# Altium schematic sheet fpga.SchDoc
size A2
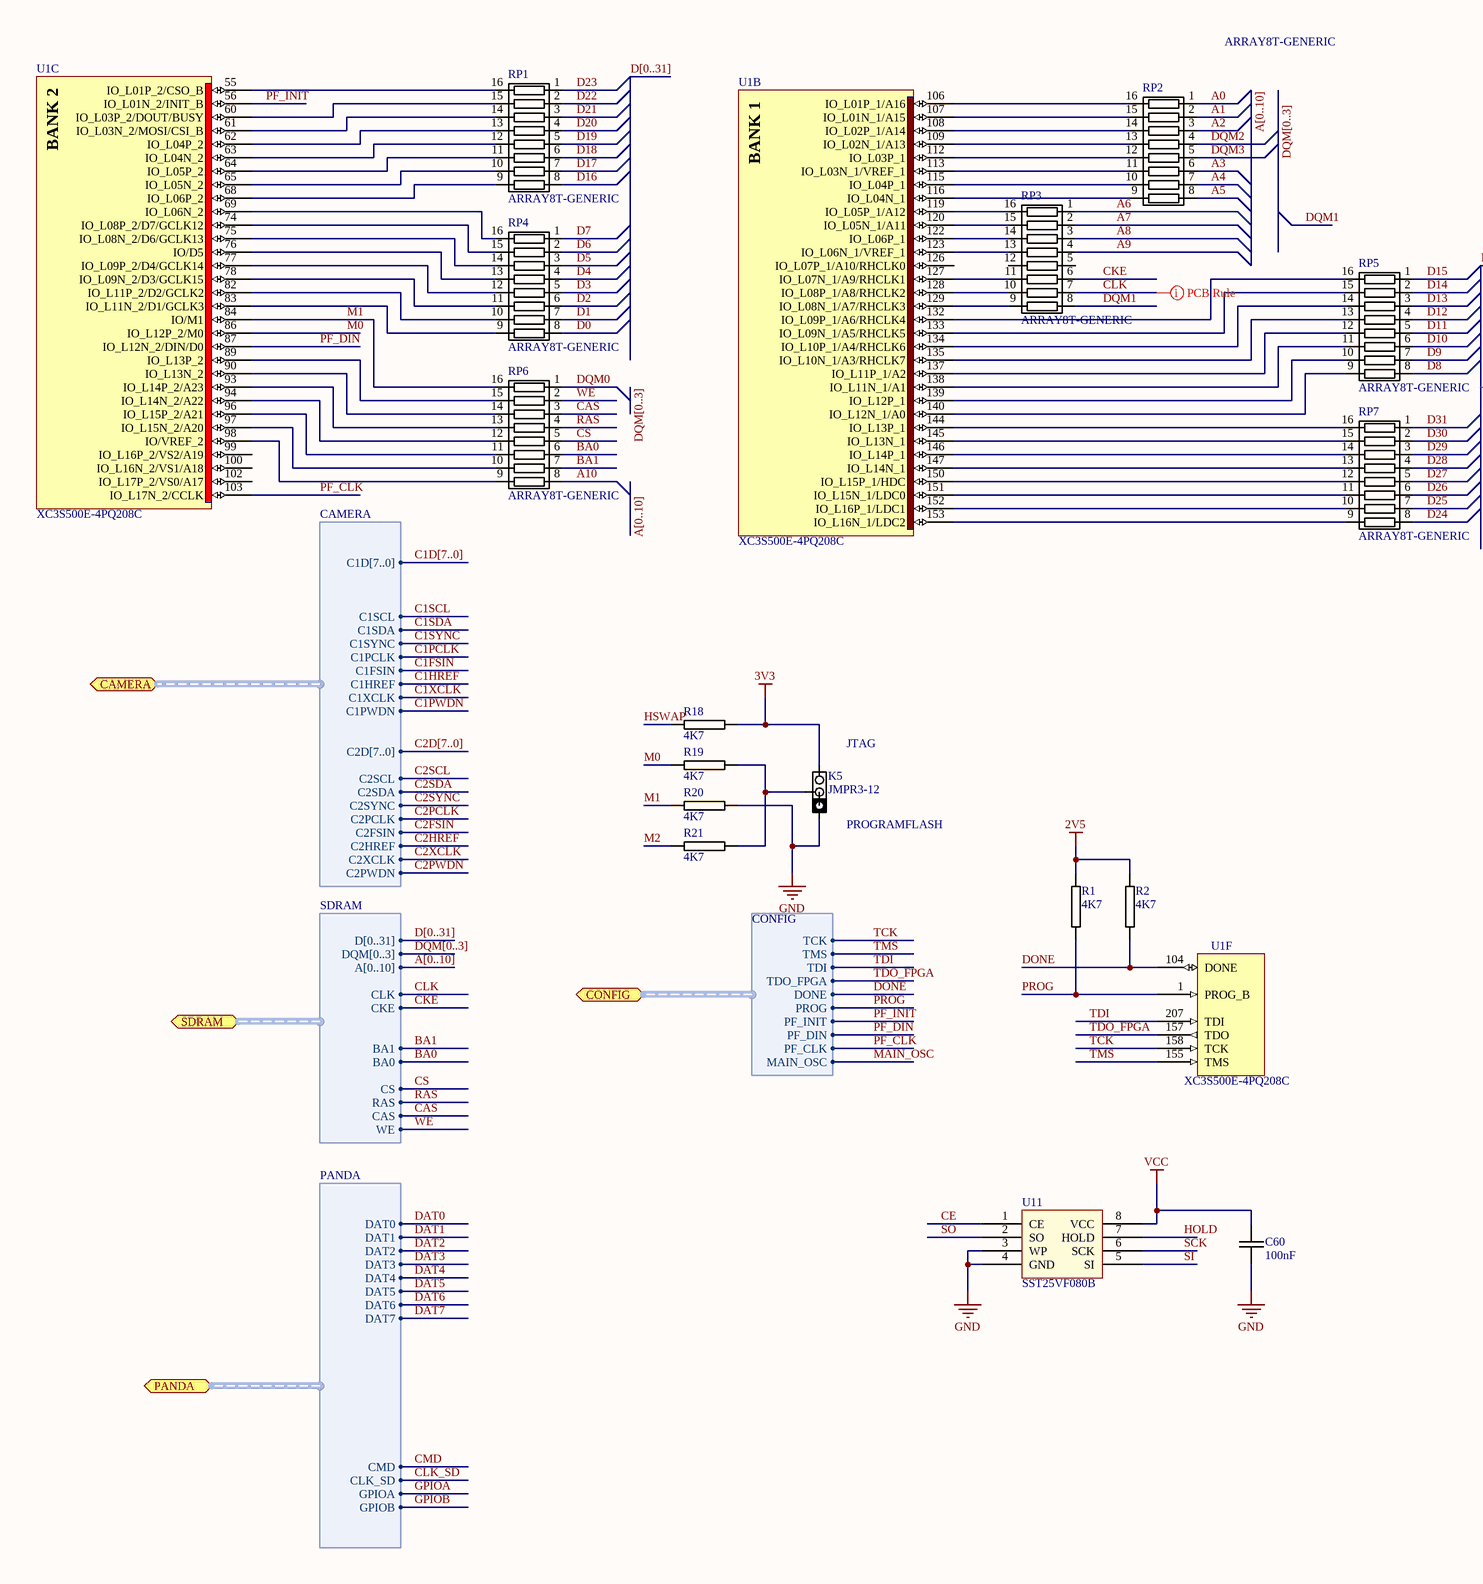
[diagram p0: fpga.SchDoc, left]
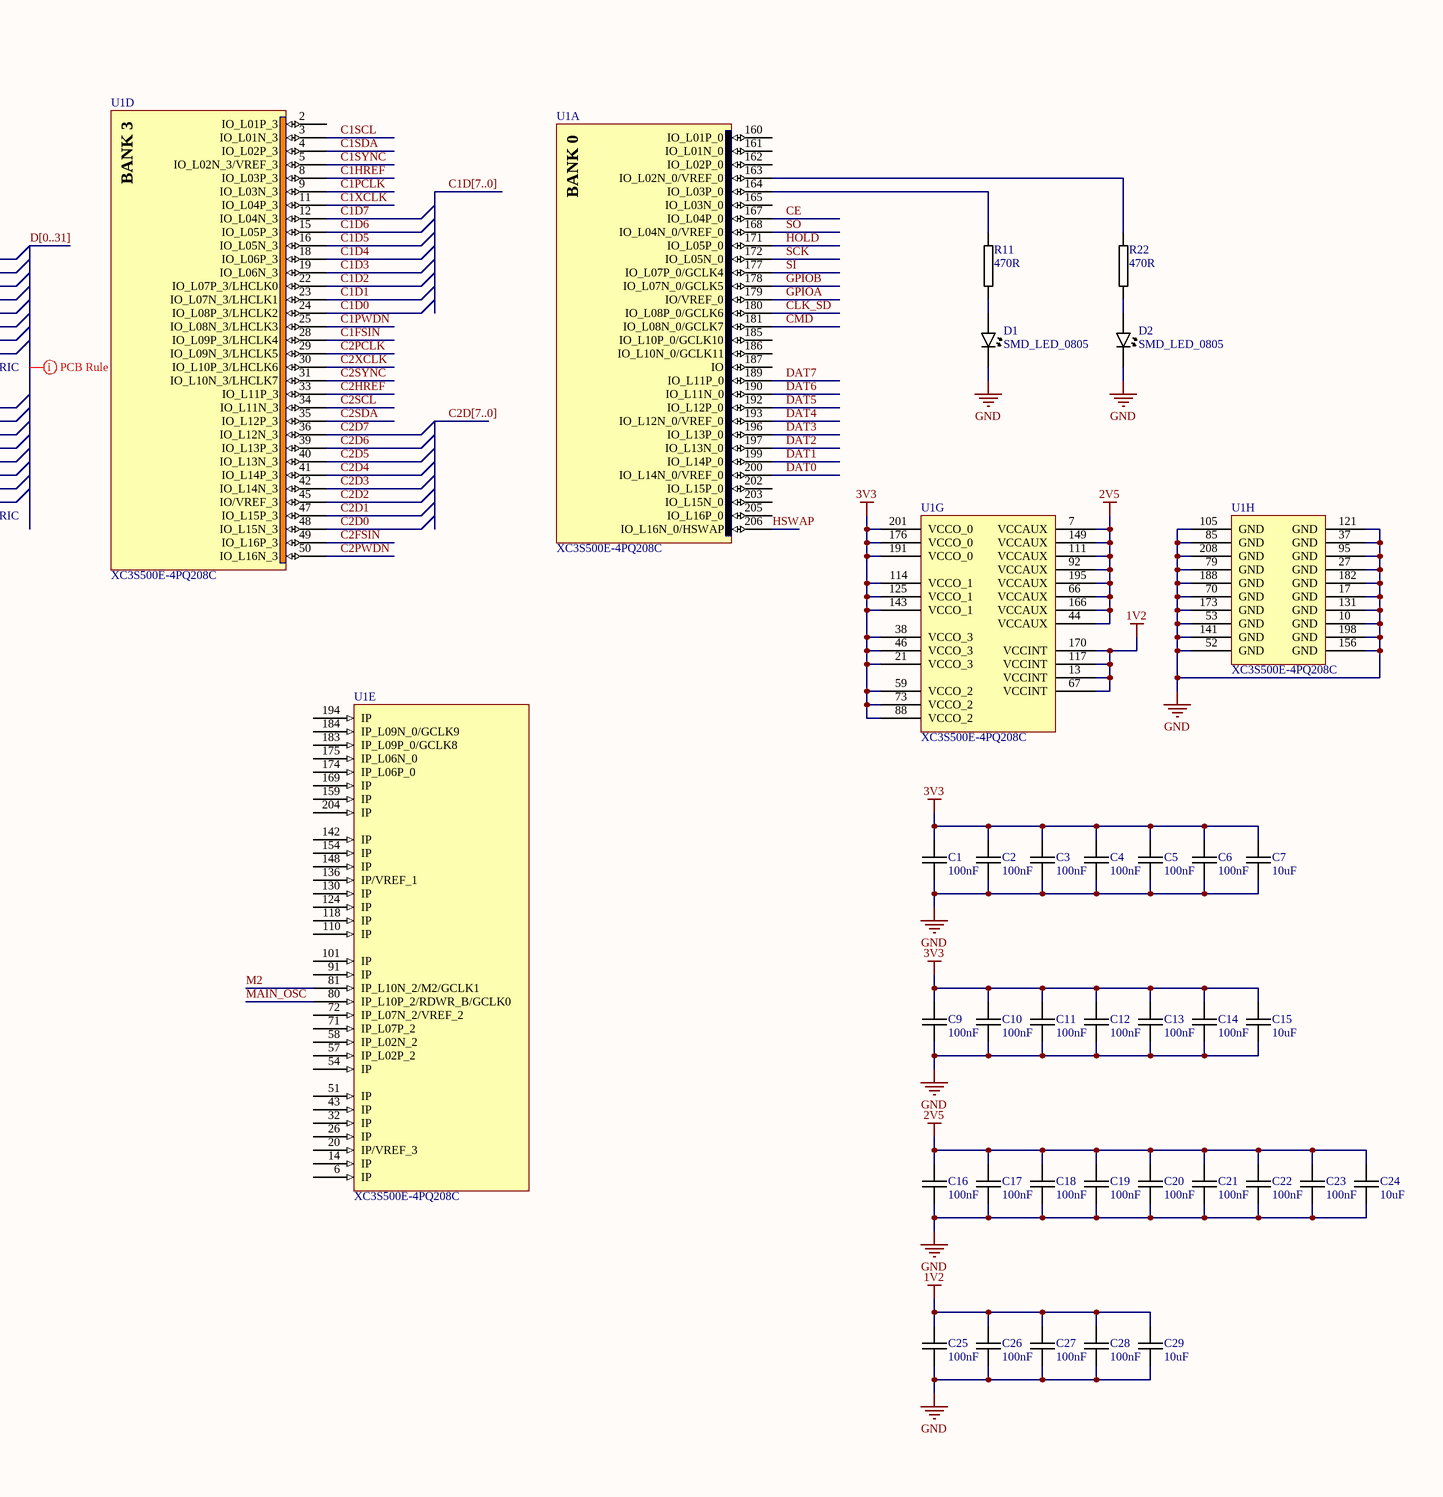
[diagram p1: fpga.SchDoc, right]

## Parts
C1  100nF  [0603C-GENERIC]
C2  100nF  [0603C-GENERIC]
C3  100nF  [0603C-GENERIC]
C4  100nF  [0603C-GENERIC]
C5  100nF  [0603C-GENERIC]
C6  100nF  [0603C-GENERIC]
C7  10uF  [0805C-GENERIC]
C9  100nF  [0603C-GENERIC]
C10  100nF  [0603C-GENERIC]
C11  100nF  [0603C-GENERIC]
C12  100nF  [0603C-GENERIC]
C13  100nF  [0603C-GENERIC]
C14  100nF  [0603C-GENERIC]
C15  10uF  [0805C-GENERIC]
C16  100nF  [0603C-GENERIC]
C17  100nF  [0603C-GENERIC]
C18  100nF  [0603C-GENERIC]
C19  100nF  [0603C-GENERIC]
C20  100nF  [0603C-GENERIC]
C21  100nF  [0603C-GENERIC]
C22  100nF  [0603C-GENERIC]
C23  100nF  [0603C-GENERIC]
C24  10uF  [0805C-GENERIC]
C25  100nF  [0603C-GENERIC]
C26  100nF  [0603C-GENERIC]
C27  100nF  [0603C-GENERIC]
C28  100nF  [0603C-GENERIC]
C29  10uF  [0805C-GENERIC]
C60  100nF  [0603C-GENERIC]
D1  SMD_LED_0805  [CD2012-0805]
D2  SMD_LED_0805  [CD2012-0805]
K5  JMPR3-12  [JMPR3-CLOSED-12]
R1  4K7  [0603R-4K7]
R2  4K7  [0603R-4K7]
R11  470R  [0603R-470]
R18  4K7  [0603R-4K7]
R19  4K7  [0603R-4K7]
R20  4K7  [0603R-4K7]
R21  4K7  [0603R-4K7]
R22  470R  [0603R-470]
RP1  ARRAY8T-GENERIC  [1206-ARRAY-8-GENERIC]
RP2  ARRAY8T-GENERIC  [1206-ARRAY-8-GENERIC]
RP3  ARRAY8T-GENERIC  [1206-ARRAY-8-GENERIC]
RP4  ARRAY8T-GENERIC  [1206-ARRAY-8-GENERIC]
RP5  ARRAY8T-GENERIC  [1206-ARRAY-8-GENERIC]
RP6  ARRAY8T-GENERIC  [1206-ARRAY-8-GENERIC]
RP7  ARRAY8T-GENERIC  [1206-ARRAY-8-GENERIC]
U1  XC3S500E-4PQ208C  [PQ208_N]  (parts A,B,C,D,E,F,G,H of 8)
U11  SST25VF080B  [SOIC127P600-8BM]

## Ports
CAMERA (harness CAMERA), CONFIG (harness CONFIG), PANDA (harness PANDA), SDRAM (harness SDRAM)

## Harnesses
CONFIG: TCK, TMS, TDI, TDO_FPGA, DONE, PROG, PF_DIN, PF_INIT, PF_CLK, MAIN_OSC
CAMERA: C1D[7..0], C1SCL, C1SDA, C1SYNC, C1PCLK, C1FSIN, C1HREF, C1XCLK, C1PWDN, C2D[7..0], C2SCL, C2SDA, C2SYNC, C2PCLK, C2HREF, C2FSIN, C2XCLK, C2PWDN
SDRAM: D[0..31], DQM[0..3], A[0..10], CLK, CKE, BA1, BA0, CS, RAS, CAS, WE
PANDA: DAT0, DAT1, DAT2, DAT3, DAT4, DAT5, DAT6, DAT7, CMD, CLK_SD, GPIOA, GPIOB

## Nets
1V2: C25.1 C26.1 C27.1 C28.1 C29.1 U1.13(VCCINT) U1.67(VCCINT) U1.117(VCCINT) U1.170(VCCINT)
2V5: C16.1 C17.1 C18.1 C19.1 C20.1 C21.1 C22.1 C23.1 C24.1 R1.1 R2.1 U1.7(VCCAUX) U1.44(VCCAUX) U1.66(VCCAUX) U1.92(VCCAUX) U1.111(VCCAUX) U1.149(VCCAUX) U1.166(VCCAUX) U1.195(VCCAUX)
3V3: C1.1 C2.1 C3.1 C4.1 C5.1 C6.1 C7.1 C9.1 C10.1 C11.1 C12.1 C13.1 C14.1 C15.1 K5.3 R18.2 U1.21(VCCO_3) U1.38(VCCO_3) U1.46(VCCO_3) U1.59(VCCO_2) U1.73(VCCO_2) U1.88(VCCO_2) U1.114(VCCO_1) U1.125(VCCO_1) U1.143(VCCO_1) U1.176(VCCO_0) U1.191(VCCO_0) U1.201(VCCO_0)
GND: C1.2 C2.2 C3.2 C4.2 C5.2 C6.2 C7.2 C9.2 C10.2 C11.2 C12.2 C13.2 C14.2 C15.2 C16.2 C17.2 C18.2 C19.2 C20.2 C21.2 C22.2 C23.2 C24.2 C25.2 C26.2 C27.2 C28.2 C29.2 C60.2 D1.2(K) D2.2(K) K5.1 R20.2 U1.10(GND) U1.17(GND) U1.27(GND) U1.37(GND) U1.52(GND) U1.53(GND) U1.70(GND) U1.79(GND) U1.85(GND) U1.95(GND) U1.105(GND) U1.121(GND) U1.131(GND) U1.141(GND) U1.156(GND) U1.173(GND) U1.182(GND) U1.188(GND) U1.198(GND) U1.208(GND) U11.3(WP) U11.4(GND)
VCC: C60.1 U11.8(VCC)
A0: RP2.1
A1: RP2.2
A2: RP2.3
A3: RP2.6
A4: RP2.7
A5: RP2.8
A6: RP3.1
A7: RP3.2
A8: RP3.3
A9: RP3.4
A10: RP6.8
BA0: RP6.6 ; port SDRAM.BA0
BA1: RP6.7 ; port SDRAM.BA1
C1D0: U1.24(IO_L08P_3/LHCLK2)
C1D1: U1.23(IO_L07N_3/LHCLK1)
C1D2: U1.22(IO_L07P_3/LHCLK0)
C1D3: U1.19(IO_L06N_3)
C1D4: U1.18(IO_L06P_3)
C1D5: U1.16(IO_L05N_3)
C1D6: U1.15(IO_L05P_3)
C1D7: U1.12(IO_L04N_3)
C1FSIN: U1.28(IO_L09P_3/LHCLK4) ; port CAMERA.C1FSIN
C1HREF: U1.8(IO_L03P_3) ; port CAMERA.C1HREF
C1PCLK: U1.9(IO_L03N_3) ; port CAMERA.C1PCLK
C1PWDN: U1.25(IO_L08N_3/LHCLK3) ; port CAMERA.C1PWDN
C1SCL: U1.3(IO_L01N_3) ; port CAMERA.C1SCL
C1SDA: U1.4(IO_L02P_3) ; port CAMERA.C1SDA
C1SYNC: U1.5(IO_L02N_3/VREF_3) ; port CAMERA.C1SYNC
C1XCLK: U1.11(IO_L04P_3) ; port CAMERA.C1XCLK
C2D0: U1.48(IO_L15N_3)
C2D1: U1.47(IO_L15P_3)
C2D2: U1.45(IO/VREF_3)
C2D3: U1.42(IO_L14N_3)
C2D4: U1.41(IO_L14P_3)
C2D5: U1.40(IO_L13N_3)
C2D6: U1.39(IO_L13P_3)
C2D7: U1.36(IO_L12N_3)
C2FSIN: U1.49(IO_L16P_3) ; port CAMERA.C2FSIN
C2HREF: U1.33(IO_L11P_3) ; port CAMERA.C2HREF
C2PCLK: U1.29(IO_L09N_3/LHCLK5) ; port CAMERA.C2PCLK
C2PWDN: U1.50(IO_L16N_3) ; port CAMERA.C2PWDN
C2SCL: U1.34(IO_L11N_3) ; port CAMERA.C2SCL
C2SDA: U1.35(IO_L12P_3) ; port CAMERA.C2SDA
C2SYNC: U1.31(IO_L10N_3/LHCLK7) ; port CAMERA.C2SYNC
C2XCLK: U1.30(IO_L10P_3/LHCLK6) ; port CAMERA.C2XCLK
CAS: RP6.3 ; port SDRAM.CAS
CE: U1.167(IO_L04P_0) U11.1(CE)
CKE: RP3.6 ; port SDRAM.CKE
CLK: RP3.7 ; port SDRAM.CLK
CLK_SD: U1.180(IO_L08P_0/GCLK6) ; port PANDA.CLK_SD
CMD: U1.181(IO_L08N_0/GCLK7) ; port PANDA.CMD
CS: RP6.5 ; port SDRAM.CS
D0: RP4.8
D1: RP4.7
D2: RP4.6
D3: RP4.5
D4: RP4.4
D5: RP4.3
D6: RP4.2
D7: RP4.1
D8: RP5.8
D9: RP5.7
D10: RP5.6
D11: RP5.5
D12: RP5.4
D13: RP5.3
D14: RP5.2
D15: RP5.1
D16: RP1.8
D17: RP1.7
D18: RP1.6
D19: RP1.5
D20: RP1.4
D21: RP1.3
D22: RP1.2
D23: RP1.1
D24: RP7.8
D25: RP7.7
D26: RP7.6
D27: RP7.5
D28: RP7.4
D29: RP7.3
D30: RP7.2
D31: RP7.1
DAT0: U1.200(IO_L14N_0/VREF_0) ; port PANDA.DAT0
DAT1: U1.199(IO_L14P_0) ; port PANDA.DAT1
DAT2: U1.197(IO_L13N_0) ; port PANDA.DAT2
DAT3: U1.196(IO_L13P_0) ; port PANDA.DAT3
DAT4: U1.193(IO_L12N_0/VREF_0) ; port PANDA.DAT4
DAT5: U1.192(IO_L12P_0) ; port PANDA.DAT5
DAT6: U1.190(IO_L11N_0) ; port PANDA.DAT6
DAT7: U1.189(IO_L11P_0) ; port PANDA.DAT7
DONE: R2.2 U1.104(DONE) ; port CONFIG.DONE
DQM0: RP6.1
DQM1: RP3.8
DQM2: RP2.4
DQM3: RP2.5
GPIOA: U1.179(IO/VREF_0) ; port PANDA.GPIOA
GPIOB: U1.178(IO_L07N_0/GCLK5) ; port PANDA.GPIOB
HOLD: U1.171(IO_L05P_0) U11.7(HOLD)
HSWAP: R18.1 U1.206(IO_L16N_0/HSWAP)
M0: R19.1 U1.86(IO_L12P_2/M0)
M1: R20.1 RP6.16 U1.84(IO/M1)
M2: R21.1 U1.81(IP_L10N_2/M2/GCLK1)
MAIN_OSC: U1.80(IP_L10P_2/RDWR_B/GCLK0) ; port CONFIG.MAIN_OSC
PF_CLK: U1.103(IO_L17N_2/CCLK) ; port CONFIG.PF_CLK
PF_DIN: U1.87(IO_L12N_2/DIN/D0) ; port CONFIG.PF_DIN
PF_INIT: U1.56(IO_L01N_2/INIT_B) ; port CONFIG.PF_INIT
PROG: R1.2 U1.1(PROG_B) ; port CONFIG.PROG
RAS: RP6.4 ; port SDRAM.RAS
SCK: U1.172(IO_L05N_0) U11.6(SCK)
SI: U1.177(IO_L07P_0/GCLK4) U11.5(SI)
SO: U1.168(IO_L04N_0/VREF_0) U11.2(SO)
TCK: U1.158(TCK) ; port CONFIG.TCK
TDI: U1.207(TDI) ; port CONFIG.TDI
TDO_FPGA: U1.157(TDO) ; port CONFIG.TDO_FPGA
TMS: U1.155(TMS) ; port CONFIG.TMS
WE: RP6.2 ; port SDRAM.WE
NetD1_1: D1.1(A) R11.2
NetD2_1: D2.1(A) R22.2
NetK5_2: K5.2 R19.2 R21.2
NetR11_1: R11.1 U1.164(IO_L03P_0)
NetR22_1: R22.1 U1.163(IO_L02N_0/VREF_0)
NetRP1_9: RP1.9 U1.68(IO_L06P_2)
NetRP1_10: RP1.10 U1.65(IO_L05N_2)
NetRP1_11: RP1.11 U1.64(IO_L05P_2)
NetRP1_12: RP1.12 U1.63(IO_L04N_2)
NetRP1_13: RP1.13 U1.62(IO_L04P_2)
NetRP1_14: RP1.14 U1.61(IO_L03N_2/MOSI/CSI_B)
NetRP1_15: RP1.15 U1.60(IO_L03P_2/DOUT/BUSY)
NetRP1_16: RP1.16 U1.55(IO_L01P_2/CSO_B)
NetRP2_9: RP2.9 U1.116(IO_L04N_1)
NetRP2_10: RP2.10 U1.115(IO_L04P_1)
NetRP2_11: RP2.11 U1.113(IO_L03N_1/VREF_1)
NetRP2_12: RP2.12 U1.112(IO_L03P_1)
NetRP2_13: RP2.13 U1.109(IO_L02N_1/A13)
NetRP2_14: RP2.14 U1.108(IO_L02P_1/A14)
NetRP2_15: RP2.15 U1.107(IO_L01N_1/A15)
NetRP2_16: RP2.16 U1.106(IO_L01P_1/A16)
NetRP3_9: RP3.9 U1.129(IO_L08N_1/A7/RHCLK3)
NetRP3_10: RP3.10 U1.128(IO_L08P_1/A8/RHCLK2)
NetRP3_11: RP3.11 U1.127(IO_L07N_1/A9/RHCLK1)
NetRP3_13: RP3.13 U1.123(IO_L06N_1/VREF_1)
NetRP3_14: RP3.14 U1.122(IO_L06P_1)
NetRP3_15: RP3.15 U1.120(IO_L05N_1/A11)
NetRP3_16: RP3.16 U1.119(IO_L05P_1/A12)
NetRP4_9: RP4.9 U1.83(IO_L11N_2/D1/GCLK3)
NetRP4_10: RP4.10 U1.82(IO_L11P_2/D2/GCLK2)
NetRP4_11: RP4.11 U1.78(IO_L09N_2/D3/GCLK15)
NetRP4_12: RP4.12 U1.77(IO_L09P_2/D4/GCLK14)
NetRP4_13: RP4.13 U1.76(IO/D5)
NetRP4_14: RP4.14 U1.75(IO_L08N_2/D6/GCLK13)
NetRP4_15: RP4.15 U1.74(IO_L08P_2/D7/GCLK12)
NetRP4_16: RP4.16 U1.69(IO_L06N_2)
NetRP5_9: RP5.9 U1.140(IO_L12N_1/A0)
NetRP5_10: RP5.10 U1.139(IO_L12P_1)
NetRP5_11: RP5.11 U1.138(IO_L11N_1/A1)
NetRP5_12: RP5.12 U1.137(IO_L11P_1/A2)
NetRP5_13: RP5.13 U1.135(IO_L10N_1/A3/RHCLK7)
NetRP5_14: RP5.14 U1.134(IO_L10P_1/A4/RHCLK6)
NetRP5_15: RP5.15 U1.133(IO_L09N_1/A5/RHCLK5)
NetRP5_16: RP5.16 U1.132(IO_L09P_1/A6/RHCLK4)
NetRP6_9: RP6.9 U1.98(IO/VREF_2)
NetRP6_10: RP6.10 U1.97(IO_L15N_2/A20)
NetRP6_11: RP6.11 U1.96(IO_L15P_2/A21)
NetRP6_12: RP6.12 U1.94(IO_L14N_2/A22)
NetRP6_13: RP6.13 U1.93(IO_L14P_2/A23)
NetRP6_14: RP6.14 U1.90(IO_L13N_2)
NetRP6_15: RP6.15 U1.89(IO_L13P_2)
NetRP7_9: RP7.9 U1.153(IO_L16N_1/LDC2)
NetRP7_10: RP7.10 U1.152(IO_L16P_1/LDC1)
NetRP7_11: RP7.11 U1.151(IO_L15N_1/LDC0)
NetRP7_12: RP7.12 U1.150(IO_L15P_1/HDC)
NetRP7_13: RP7.13 U1.147(IO_L14N_1)
NetRP7_14: RP7.14 U1.146(IO_L14P_1)
NetRP7_15: RP7.15 U1.145(IO_L13N_1)
NetRP7_16: RP7.16 U1.144(IO_L13P_1)

Not connected (* = marked no-connect by the designer): RP3 5 12; U1 2(IO_L01P_3) 6(IP) 14(IP) 20(IP/VREF_3) 26(IP) 32(IP) 43(IP) 51(IP) 54(IP) 57(IP_L02P_2) 58(IP_L02N_2) 71(IP_L07P_2) 72(IP_L07N_2/VREF_2) 91(IP) 99(IO_L16P_2/VS2/A19) 100(IO_L16N_2/VS1/A18) 101(IP) 102(IO_L17P_2/VS0/A17) 110(IP) 118(IP) 124(IP) 126(IO_L07P_1/A10/RHCLK0) 130(IP) 136(IP/VREF_1) 142(IP) 148(IP) 154(IP) 159(IP) 160(IO_L01P_0) 161(IO_L01N_0) 162(IO_L02P_0) 165(IO_L03N_0) 169(IP) 174(IP_L06P_0) 175(IP_L06N_0) 183(IP_L09P_0/GCLK8) 184(IP_L09N_0/GCLK9) 185(IO_L10P_0/GCLK10) 186(IO_L10N_0/GCLK11) 187(IO) 194(IP) 202(IO_L15P_0) 203(IO_L15N_0) 204(IP) 205(IO_L16P_0)

## Buses and harness runs
bus A[0..10]
bus C1D[7..0]
bus C2D[7..0]
bus D[0..31]
bus DQM[0..3]

## Layout directives
rule Matched Net Lengths [Tolerance = 500mil]: (no net found under the mark)
rule Length Constraint [Min Length = 35mm    Max Length = 50mm]: CLK

## Notes on the sheet
- (near K5) JTAG
- (near K5) PROGRAMFLASH
- (in symbol XC3S500E-4PQ208C, part A) BANK 0
- (in symbol XC3S500E-4PQ208C, part B) BANK 1
- (in symbol XC3S500E-4PQ208C, part C) BANK 2
- (in symbol XC3S500E-4PQ208C, part D) BANK 3

## Library data of the parts
C1-C6 C9-C14 C16-C23 C25-C28 C60 = 0603C-100NF-50V-X7R-TDK: GENERIC CAPACITOR NON POLARISED 0603; Manufacturer Part Number: C1608X7R1H103K; Manufacturer: TDK Corporation; Temperature Coefficient: X7R; Tolerance: ±10%; Voltage - Rated: 50V; Capacitance: 10000pF; Description: CAP CER 10000PF 50V X7R 10% 0603; Reel: C68; RoHS: RoHS Compliant; Lead Spacing: -; Package / Case: 0603 (1608 metric); Features: General Purpose; Packaging: Tape & Reel (TR); Thickness: 0.80mm; Operating Temperature: -55°C ~ 125°C; Mounting Type: Surface Mount, MLCC; Category: Capacitors; Supplier 1: Digi-Key; Supplier Part Number 1: 445-1314-2-ND
C7 C15 C24 C29 = 0805C-10UF-16V-X5R-TDK: CAPACITOR 0805 CERAMIC; Manufacturer Part Number: C2012X5R1C106M; Manufacturer: TDK Corporation; REEL: C63; Description: CAP CER 10UF 16V X5R 0805; Supplier 1: Digi-Key; Supplier Part Number 1: 445-4115-2-ND
K5 = JMPR3-12: JMPR3; Manufacturer: Sullins Connector Solutions; Manufacturer Part Number: PBC36SAAN; Description: CONN HEADER .100 SINGL STR 36POS; Reel: Closed 1-2; Supplier 1: Digi-Key; Supplier Part Number 1: S1011E-36-ND
R1 R2 R18-R21 = 0603R-4K7: GENERIC RESISTOR 0603; Manufacturer: Stackpole Electronics Inc; Manufacturer Part Number: RMCF 1/16 4.7K 1% R; Description: RES 4.7K OHM 1/10W 1% 0603 SMD; Reel: R23; Supplier 1: Digi-Key; Supplier Part Number 1: RMCF1/164.7KFRTR-ND
R11 R22 = 0603R-470: GENERIC RESISTOR 0603; Manufacturer Part Number: RMCF 1/16 470 1% R; Manufacturer: Stackpole Electronics Inc; Tolerance: ±1%; Power (Watts): 0.1W, 1/10W; Temperature Coefficient: ±100ppm/°C; Resistance In Ohms: 470; Description: RES 470 OHM 1/10W 1% 0603 SMD; Reel: R17; Supplier 1: Digi-Key; Supplier Part Number 1: RMCF1/16470FRTR-ND; Supplier: Digi-Key; Composition: Thick Film; Packaging: Tape & Reel (TR); Lead Style: Surface Mount (SMD - SMT); Category: Resistors; RoHS: RoHS Compliant; Supplier Part Number: RMCF1/16470FRTR-ND; Case: 0603 (1608 metric)
RP1-RP7 = ARRAY8T-GENERIC: GENERIC RESISTOR ARRAY 8X INDEPENDENT
U1 = XC3S500E-4PQ208C: Spartan-3E 1.2V FPGA, 158 User I/Os, 208-Pin PQFP, Standard Performance, Commercial Grade; Published: 6-Jun-2005; LatestRevisionDate: 30-Oct-2009; LatestRevisionNote: Updated to datasheet version 3.8 Aug-2009.; DatasheetVersion: ver3.8, Aug-2009; PackageVersion: ver1.2, Jun-2004; PackageReference: PQ208; Publisher: Altium Limited; PackageDescription: 208-Pin Plastic Quad Flat Pack (PQ208); Code_JEDEC: MS-029-FA-1; ComponentLink1Description: Spartan-3E Datasheet; ComponentLink1URL: http://www.xilinx.com/support/documentation/data_sheets/ds312.pdf; ComponentLink2Description: PQ208 Package Drawing; ComponentLink2URL: http://www.xilinx.com/support/documentation/package_specs/pq208.pdf; ComponentLink3Description: Spartan-3E Documents; ComponentLink3URL: http://www.xilinx.com/support/documentation/spartan-3e.htm; ComponentLink4Description: Xilinx.com Home; ComponentLink4URL: http://www.xilinx.com